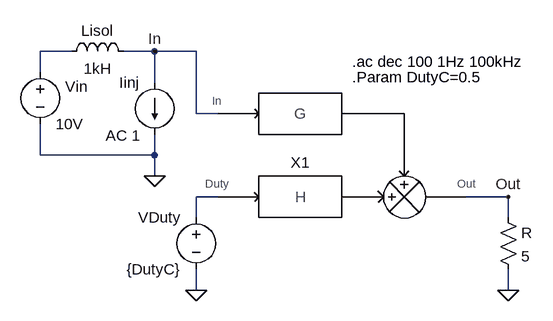
[diagram p0: schematic SchBlk-Buck-VM-Input Impedance Open.asc]
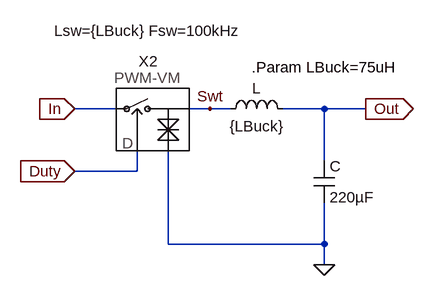
[diagram p1: sub-circuit buck-vm-power_train.asc]
SchBlk-Buck-VM-Input Impedance Open.asc, the LTspice schematic file:
Version 4
SHEET 1 880 696
WIRE -144 -144 -192 -144
WIRE -16 -144 -64 -144
WIRE 48 -144 -16 -144
WIRE -192 -112 -192 -144
WIRE -16 -96 -16 -144
WIRE 48 -48 48 -144
WIRE 80 -48 48 -48
WIRE -192 16 -192 -32
WIRE -16 16 -16 -16
WIRE -16 16 -192 16
WIRE -16 48 -16 16
WIRE 80 80 48 80
WIRE 528 80 464 80
WIRE 48 112 48 80
WIRE 528 112 528 80
WIRE 48 224 48 192
WIRE 528 224 528 192
FLAG 528 224 0
FLAG -16 -144 In
FLAG 528 80 Out
FLAG -16 48 0
FLAG 48 224 0
SYMBOL voltage -192 -128 R0
WINDOW 123 24 124 Left 2
WINDOW 39 0 0 Left 2
WINDOW 0 38 38 Left 2
SYMATTR InstName Vin
SYMATTR Value 10V
SYMBOL res 512 96 R0
SYMATTR InstName R
SYMATTR Value 5
SYMBOL voltage 48 96 M0
SYMATTR InstName VDuty
SYMATTR Value {DutyC}
SYMBOL current -16 -96 M0
WINDOW 123 22 82 Left 2
WINDOW 39 0 0 Left 2
SYMATTR Value2 AC 1
SYMATTR InstName Iinj
SYMATTR Value ""
SYMBOL ind -160 -128 R270
WINDOW 0 32 56 VTop 2
WINDOW 3 5 56 VBottom 2
SYMATTR InstName Lisol
SYMATTR Value 1kH
SYMBOL Buck-VM-Power_Train 208 80 R0
SYMATTR InstName X1
TEXT 288 -104 Left 2 !.Param DutyC=0.5
TEXT 288 -128 Left 2 !.ac dec 100 1Hz 100kHz

buck-vm-power_train.asc, the sub-circuit schematic file:
Version 4
SHEET 1 880 696
WIRE 80 48 16 48
WIRE 224 48 192 48
WIRE 256 48 224 48
WIRE 400 48 336 48
WIRE 464 48 400 48
WIRE 400 128 400 48
WIRE 112 144 112 112
WIRE 112 144 16 144
WIRE 160 256 160 112
WIRE 400 256 400 192
WIRE 400 256 160 256
WIRE 400 288 400 256
FLAG 400 288 0
FLAG 16 48 In
IOPIN 16 48 In
FLAG 464 48 Out
IOPIN 464 48 Out
FLAG 224 48 Swt
FLAG 16 144 Duty
IOPIN 16 144 In
SYMBOL ind 240 64 R270
WINDOW 0 32 56 VTop 2
WINDOW 3 5 56 VBottom 2
SYMATTR InstName L
SYMATTR Value {LBuck}
SYMBOL cap 384 128 R0
SYMATTR InstName C
SYMATTR Value 220µF
SYMATTR SpiceLine Rser=70m
SYMBOL PWM-VM 128 64 R0
WINDOW 39 0 -112 Invisible 2
SYMATTR InstName X2
SYMATTR SpiceLine2 Lsw={LBuck} Fsw=100kHz
TEXT 288 -16 Left 2 !.Param LBuck=75uH

The netlist it stands for:
* SchBlk-Buck-VM-Input Impedance Open.asc
Vin N001 0 10V
R Out 0 5
VDuty N002 0 {DutyC}
Iinj In 0 AC 1
Lisol N001 In 1kH
XX1 N002 In Out buck-vm-power_train

* block symbol definitions
.subckt buck-vm-power_train Duty In Out
L Swt Out {LBuck}
C Out 0 220µF Rser=70m
XX2 In Swt 0 Duty PWM-VM params: DCMin=0.05 DCMax=0.95 Lsw={LBuck} Fsw=100kHz  ; pins nA nC nP nD
.Param LBuck=75uH
.ends buck-vm-power_train

.Param DutyC=0.5
.ac dec 100 1Hz 100kHz
.backanno
.end